# Altium schematic sheet IMU.SchDoc
size A4; SheetNumber: 4; SheetTotal: 8
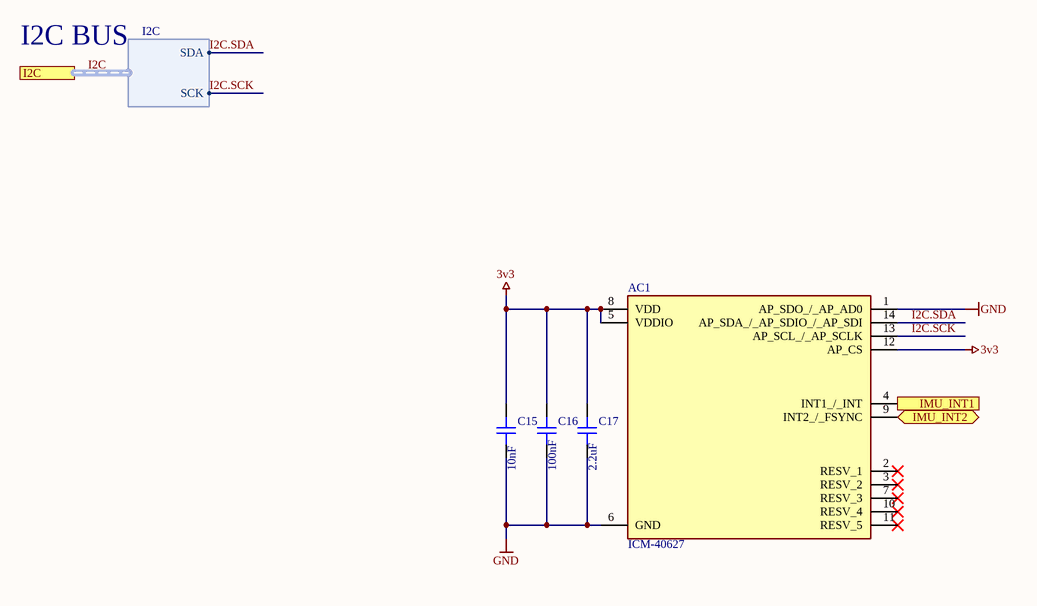
[diagram p0: IMU.SchDoc]

## Parts
AC1  ICM-40627  [ICM-40627]
C15  value 10nF  [CAP_0402]  (hidden comment: C0402_10V)
C16  value 100nF  [CAP_0402]  (hidden comment: C0402_10V)
C17  value 2.2uF  [CAP_0402]  (hidden comment: C0402_10V)

## Ports
I2C (harness I2C, see Top Level Organization[3A], ESP[1A], MAG[1A]), IMU_INT1 (out, see Top Level Organization[3B], ESP[3C]), IMU_INT2 (bidir, see Top Level Organization[3B], ESP[3C])

## Harnesses
I2C: SDA, SCK

## Nets
3v3: AC1.5(VDDIO) AC1.8(VDD) AC1.12(AP_CS) C15.2 C16.2 C17.2
GND: AC1.1(AP_SDO_/_AP_AD0) AC1.6(GND) C15.1 C16.1 C17.1
I2C.SCK: AC1.13(AP_SCL_/_AP_SCLK) ; port I2C.SCK
I2C.SDA: AC1.14(AP_SDA_/_AP_SDIO_/_AP_SDI) ; port I2C.SDA
IMU_INT1: AC1.4(INT1_/_INT) ; port IMU_INT1
IMU_INT2: AC1.9(INT2_/_FSYNC) ; port IMU_INT2

Not connected (* = marked no-connect by the designer): AC1 2(RESV_1)* 3(RESV_2)* 7(RESV_3)* 10(RESV_4)* 11(RESV_5)*

## Buses and harness runs
harness I2C = port I2C

## Notes on the sheet
- I2C BUS

## Library data of the parts
AC1 = ICM-40627: Accelerometer; Manufacturer_Name: TDK; Datasheet Link: https://3cfeqx1hf82y3xcoull08ihx-wpengine.netdna-ssl.com/wp-content/uploads/2021/04/DS-000381-ICM-40627-v1.2.pdf; Manufacturer_Part_Number: ICM-40627; Mouser Part Number: 410-ICM-40627; Mouser Price/Stock: https://www.mouser.co.uk/ProductDetail/TDK-InvenSense/ICM-40627?qs=iLbezkQI%252BsgePVjJNSY7vQ%3D%3D; Arrow Part Number: ICM-40627; Arrow Price/Stock: https://www.arrow.com/en/products/icm-40627/invensense?region=nac
C15-C17 = CAP_0402_10V: Capacitor SMD 0402 10V